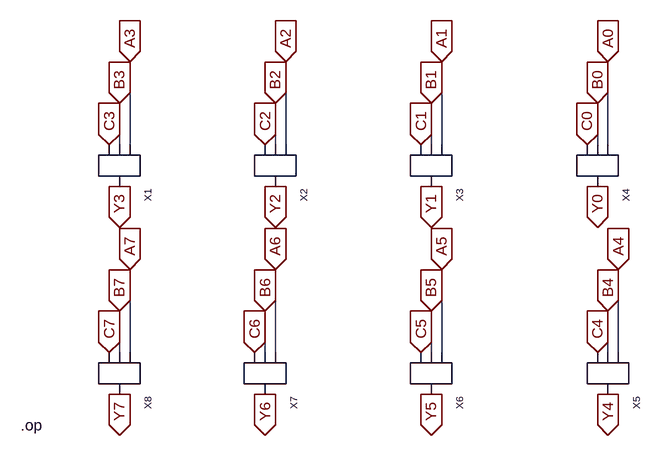
[diagram p0: schematic 8bit_OR.asc]
8bit_OR.asc, the LTspice schematic file:
Version 4
SHEET 1 880 680
WIRE -304 -80 -304 -144
WIRE -288 -80 -288 -208
WIRE -64 -80 -64 -144
WIRE -48 -80 -48 -208
WIRE 176 -80 176 -144
WIRE 192 -80 192 -208
WIRE 432 -80 432 -144
WIRE 448 -80 448 -208
WIRE -304 240 -304 176
WIRE -288 240 -288 112
WIRE -80 240 -80 176
WIRE -64 240 -64 112
WIRE 176 240 176 176
WIRE 192 240 192 112
WIRE 448 240 448 176
WIRE 464 240 464 112
FLAG 448 -208 A0
IOPIN 448 -208 In
FLAG 192 -208 A1
IOPIN 192 -208 In
FLAG -48 -208 A2
IOPIN -48 -208 In
FLAG -288 -208 A3
IOPIN -288 -208 In
FLAG 464 112 A4
IOPIN 464 112 In
FLAG 192 112 A5
IOPIN 192 112 In
FLAG -64 112 A6
IOPIN -64 112 In
FLAG -288 112 A7
IOPIN -288 112 In
FLAG 176 -144 B1
IOPIN 176 -144 In
FLAG 432 -144 B0
IOPIN 432 -144 In
FLAG -64 -144 B2
IOPIN -64 -144 In
FLAG -304 -144 B3
IOPIN -304 -144 In
FLAG -80 176 B6
IOPIN -80 176 In
FLAG 176 176 B5
IOPIN 176 176 In
FLAG 448 176 B4
IOPIN 448 176 In
FLAG -304 176 B7
IOPIN -304 176 In
FLAG 416 -80 C0
IOPIN 416 -80 In
FLAG 160 -80 C1
IOPIN 160 -80 In
FLAG -80 -80 C2
IOPIN -80 -80 In
FLAG -320 -80 C3
IOPIN -320 -80 In
FLAG 432 240 C4
IOPIN 432 240 In
FLAG 160 240 C5
IOPIN 160 240 In
FLAG -96 240 C6
IOPIN -96 240 In
FLAG -320 240 C7
IOPIN -320 240 In
FLAG 432 -16 Y0
IOPIN 432 -16 Out
FLAG 176 -16 Y1
IOPIN 176 -16 Out
FLAG -64 -16 Y2
IOPIN -64 -16 Out
FLAG -304 -16 Y3
IOPIN -304 -16 Out
FLAG 448 304 Y4
IOPIN 448 304 Out
FLAG 176 304 Y5
IOPIN 176 304 Out
FLAG -80 304 Y6
IOPIN -80 304 Out
FLAG -304 304 Y7
IOPIN -304 304 Out
SYMBOL OR -320 48 R90
SYMATTR InstName X1
SYMBOL OR -80 48 R90
SYMATTR InstName X2
SYMBOL OR 160 48 R90
SYMATTR InstName X3
SYMBOL OR 416 48 R90
SYMATTR InstName X4
SYMBOL OR 432 368 R90
SYMATTR InstName X5
SYMBOL OR 160 368 R90
SYMATTR InstName X6
SYMBOL OR -96 368 R90
SYMATTR InstName X7
SYMBOL OR -320 368 R90
SYMATTR InstName X8
TEXT -456 352 Left 2 !.op

The netlist it stands for:
* 8bit_OR.asc
XX1 A3 B3 C3 Y3 OR  ; pins A B C Y
XX2 A2 B2 C2 Y2 OR  ; pins A B C Y
XX3 A1 B1 C1 Y1 OR  ; pins A B C Y
XX4 A0 B0 C0 Y0 OR  ; pins A B C Y
XX5 A4 B4 C4 Y4 OR  ; pins A B C Y
XX6 A5 B5 C5 Y5 OR  ; pins A B C Y
XX7 A6 B6 C6 Y6 OR  ; pins A B C Y
XX8 A7 B7 C7 Y7 OR  ; pins A B C Y
.op
.backanno
.end